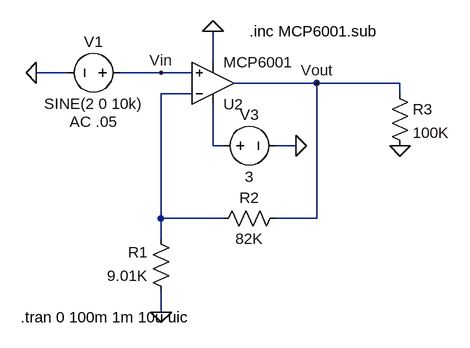
[diagram p0: schematic CC-Load-01.asc]
CC-Load-01.asc, the LTspice schematic file:
Version 4
SHEET 1 880 680
WIRE 224 128 224 80
WIRE 0 144 -48 144
WIRE 144 144 80 144
WIRE 192 144 144 144
WIRE 384 160 256 160
WIRE 512 160 384 160
WIRE 192 176 144 176
WIRE 512 176 512 160
WIRE 224 256 224 192
WIRE 240 256 224 256
WIRE 352 256 320 256
WIRE 144 368 144 176
WIRE 240 368 144 368
WIRE 384 368 384 160
WIRE 384 368 320 368
WIRE 144 400 144 368
WIRE 144 512 144 480
FLAG -48 144 0
FLAG 144 512 0
FLAG 352 256 0
FLAG 384 160 Vout
FLAG 144 144 Vin
FLAG 224 80 0
FLAG 512 256 0
SYMBOL Opamps\\opamp2 224 224 M180
SYMATTR InstName U2
SYMATTR Value MCP6001
SYMBOL voltage 96 144 R90
WINDOW 0 -32 56 VBottom 2
WINDOW 3 32 56 VTop 2
WINDOW 123 60 56 VTop 2
WINDOW 39 0 0 Left 2
SYMATTR InstName V1
SYMATTR Value SINE(2 0 10k)
SYMATTR Value2 AC .05
SYMBOL voltage 224 256 R270
WINDOW 0 32 56 VTop 2
WINDOW 3 -32 56 VBottom 2
WINDOW 123 0 0 Left 2
WINDOW 39 0 0 Left 2
SYMATTR InstName V3
SYMATTR Value 3
SYMBOL res 160 496 R180
WINDOW 0 36 76 Left 2
WINDOW 3 36 40 Left 2
SYMATTR InstName R1
SYMATTR Value 9.01K
SYMBOL res 224 384 R270
WINDOW 0 32 56 VTop 2
WINDOW 3 0 56 VBottom 2
SYMATTR InstName R2
SYMATTR Value 82K
SYMBOL res 496 160 R0
SYMATTR InstName R3
SYMATTR Value 100K
TEXT -72 520 Left 2 !.tran 0 100m 1m 10u uic
TEXT 280 80 Left 2 !.inc MCP6001.sub

The netlist it stands for:
* CC-Load-01.asc
XU2 Vin N001 N002 0 Vout MCP6001  ; pins In+ In- V+ V- OUT
V1 Vin 0 SINE(2 0 10k) AC .05
V3 N002 0 3
R1 0 N001 9.01K
R2 N001 Vout 82K
R3 Vout 0 100K
.tran 0 100m 1m 10u uic
.inc MCP6001.sub
.backanno
.end